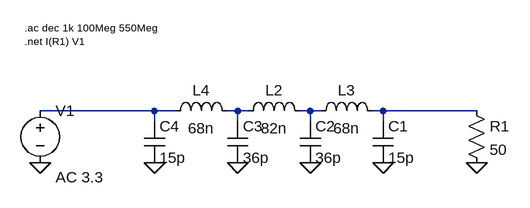
[diagram p0: schematic LO_Impedence_Matching.asc]
LO_Impedence_Matching.asc, the LTspice schematic file:
Version 4
SHEET 1 880 680
WIRE 64 272 -112 272
WIRE 96 272 64 272
WIRE 192 272 176 272
WIRE 208 272 192 272
WIRE 304 272 288 272
WIRE 320 272 304 272
WIRE 416 272 400 272
WIRE 560 272 416 272
WIRE 64 288 64 272
WIRE 192 288 192 272
WIRE 304 288 304 272
WIRE 416 288 416 272
FLAG -112 352 0
FLAG 192 352 0
FLAG 304 352 0
FLAG 416 352 0
FLAG 560 352 0
FLAG 64 352 0
SYMBOL ind 304 288 R270
WINDOW 0 32 56 VTop 2
WINDOW 3 5 56 VBottom 2
SYMATTR InstName L3
SYMATTR Value 68n
SYMATTR SpiceLine Ipk=800m Cpar=0 mfg="   ---" pn="   ---"
SYMBOL ind 192 288 R270
WINDOW 0 32 56 VTop 2
WINDOW 3 5 56 VBottom 2
SYMATTR InstName L2
SYMATTR Value 82n
SYMATTR SpiceLine Ipk=800m Cpar=0 mfg="   ---" pn="   ---"
SYMBOL ind 80 288 R270
WINDOW 0 32 56 VTop 2
WINDOW 3 5 56 VBottom 2
SYMATTR InstName L4
SYMATTR Value 68n
SYMATTR SpiceLine Ipk=800m Cpar=0 mfg="   ---" pn="   ---"
SYMBOL cap 176 288 R0
SYMATTR InstName C3
SYMATTR Value 36p
SYMATTR SpiceLine Rser=0 Lser=0 mfg="   ---" pn="   ---" type="   ---"
SYMBOL cap 400 288 R0
SYMATTR InstName C1
SYMATTR Value 15p
SYMBOL cap 288 288 R0
SYMATTR InstName C2
SYMATTR Value 36p
SYMBOL voltage -112 256 R0
WINDOW 123 24 118 Left 2
SYMATTR Value2 AC 3.3
SYMATTR InstName V1
SYMATTR Value ""
SYMATTR SpiceLine Rser=50
SYMBOL res 544 256 R0
SYMATTR InstName R1
SYMATTR Value 50
SYMBOL cap 48 288 R0
SYMATTR InstName C4
SYMATTR Value 15p
SYMATTR SpiceLine Rser=0 Lser=0 mfg="   ---" pn="   ---" type="   ---"
TEXT -136 144 Left 1 !.ac dec 1k 100Meg 550Meg\n.net I(R1) V1

The netlist it stands for:
* LO_Impedence_Matching.asc
L3 N003 N004 68n Ipk=800m Cpar=0 mfg="   ---" pn="   ---"
L2 N002 N003 82n Ipk=800m Cpar=0 mfg="   ---" pn="   ---"
L4 N001 N002 68n Ipk=800m Cpar=0 mfg="   ---" pn="   ---"
C3 N002 0 36p Rser=0 Lser=0 mfg="   ---" pn="   ---" type="   ---"
C1 N004 0 15p
C2 N003 0 36p
V1 N001 0 AC 3.3 Rser=50
R1 N004 0 50
C4 N001 0 15p Rser=0 Lser=0 mfg="   ---" pn="   ---" type="   ---"
.ac dec 1k 100Meg 550Meg
.net I(R1) V1
.backanno
.end